# Altium schematic sheet mofang.SchDoc
size A4
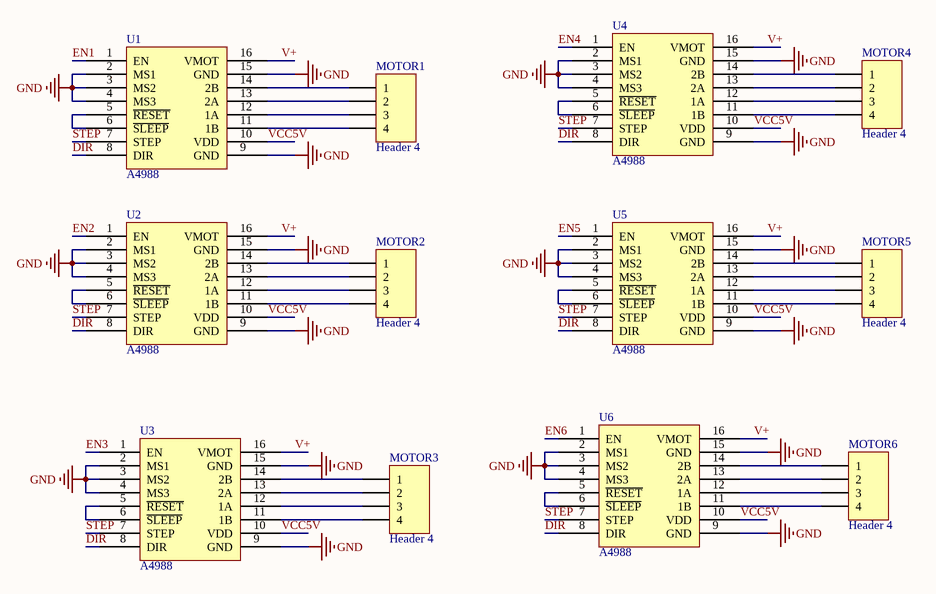
[diagram p0: mofang.SchDoc]

## Parts
MOTOR1  Header 4  [HDR1X4]
MOTOR2  Header 4  [HDR1X4]
MOTOR3  Header 4  [HDR1X4]
MOTOR4  Header 4  [HDR1X4]
MOTOR5  Header 4  [HDR1X4]
MOTOR6  Header 4  [HDR1X4]
U1  A4988  [A4988]
U2  A4988  [A4988]
U3  A4988  [A4988]
U4  A4988  [A4988]
U5  A4988  [A4988]
U6  A4988  [A4988]

## Nets
GND: U1.2(MS1) U1.3(MS2) U1.4(MS3) U1.9(GND) U1.15(GND) U2.2(MS1) U2.3(MS2) U2.4(MS3) U2.9(GND) U2.15(GND) U3.2(MS1) U3.3(MS2) U3.4(MS3) U3.9(GND) U3.15(GND) U4.2(MS1) U4.3(MS2) U4.4(MS3) U4.9(GND) U4.15(GND) U5.2(MS1) U5.3(MS2) U5.4(MS3) U5.9(GND) U5.15(GND) U6.2(MS1) U6.3(MS2) U6.4(MS3) U6.9(GND) U6.15(GND)
DIR: U1.8(DIR) U2.8(DIR) U3.8(DIR) U4.8(DIR) U5.8(DIR) U6.8(DIR)
EN1: U1.1(EN)
EN2: U2.1(EN)
EN3: U3.1(EN)
EN4: U4.1(EN)
EN5: U5.1(EN)
EN6: U6.1(EN)
STEP: U1.7(STEP) U2.7(STEP) U3.7(STEP) U4.7(STEP) U5.7(STEP) U6.7(STEP)
V+: U1.16(VMOT) U2.16(VMOT) U3.16(VMOT) U4.16(VMOT) U5.16(VMOT) U6.16(VMOT)
VCC5V: U1.10(VDD) U2.10(VDD) U3.10(VDD) U4.10(VDD) U5.10(VDD) U6.10(VDD)
NetMOTOR1_1: MOTOR1.1 U1.14(2B)
NetMOTOR1_2: MOTOR1.2 U1.13(2A)
NetMOTOR1_3: MOTOR1.3 U1.12(1A)
NetMOTOR1_4: MOTOR1.4 U1.11(1B)
NetMOTOR2_1: MOTOR2.1 U2.14(2B)
NetMOTOR2_2: MOTOR2.2 U2.13(2A)
NetMOTOR2_3: MOTOR2.3 U2.12(1A)
NetMOTOR2_4: MOTOR2.4 U2.11(1B)
NetMOTOR3_1: MOTOR3.1 U3.14(2B)
NetMOTOR3_2: MOTOR3.2 U3.13(2A)
NetMOTOR3_3: MOTOR3.3 U3.12(1A)
NetMOTOR3_4: MOTOR3.4 U3.11(1B)
NetMOTOR4_1: MOTOR4.1 U4.14(2B)
NetMOTOR4_2: MOTOR4.2 U4.13(2A)
NetMOTOR4_3: MOTOR4.3 U4.12(1A)
NetMOTOR4_4: MOTOR4.4 U4.11(1B)
NetMOTOR5_1: MOTOR5.1 U5.14(2B)
NetMOTOR5_2: MOTOR5.2 U5.13(2A)
NetMOTOR5_3: MOTOR5.3 U5.12(1A)
NetMOTOR5_4: MOTOR5.4 U5.11(1B)
NetMOTOR6_1: MOTOR6.1 U6.14(2B)
NetMOTOR6_2: MOTOR6.2 U6.13(2A)
NetMOTOR6_3: MOTOR6.3 U6.12(1A)
NetMOTOR6_4: MOTOR6.4 U6.11(1B)
NetU1_5: U1.5(~{RESET}) U1.6(~{SLEEP})
NetU2_5: U2.5(~{RESET}) U2.6(~{SLEEP})
NetU3_5: U3.5(~{RESET}) U3.6(~{SLEEP})
NetU4_5: U4.5(~{RESET}) U4.6(~{SLEEP})
NetU5_5: U5.5(~{RESET}) U5.6(~{SLEEP})
NetU6_5: U6.5(~{RESET}) U6.6(~{SLEEP})

## Library data of the parts
MOTOR1-MOTOR6 = Header 4: Header, 4-Pin; LatestRevisionDate: 17-Jul-2002; LatestRevisionNote: Re-released for DXP Platform.; Publisher: Altium Limited